# EasyEDA Pro project 电池盒升压.eprj

# Schematic Schematic1
Board Name: Board1; Create Date: 2025-10-24; Page Name: P1; Project Name: 电池盒升压; Schematic Name: Schematic1; Update Date: 2025-10-24; Company: 嘉立创EDA; Page Size: A4; Version: V1.0
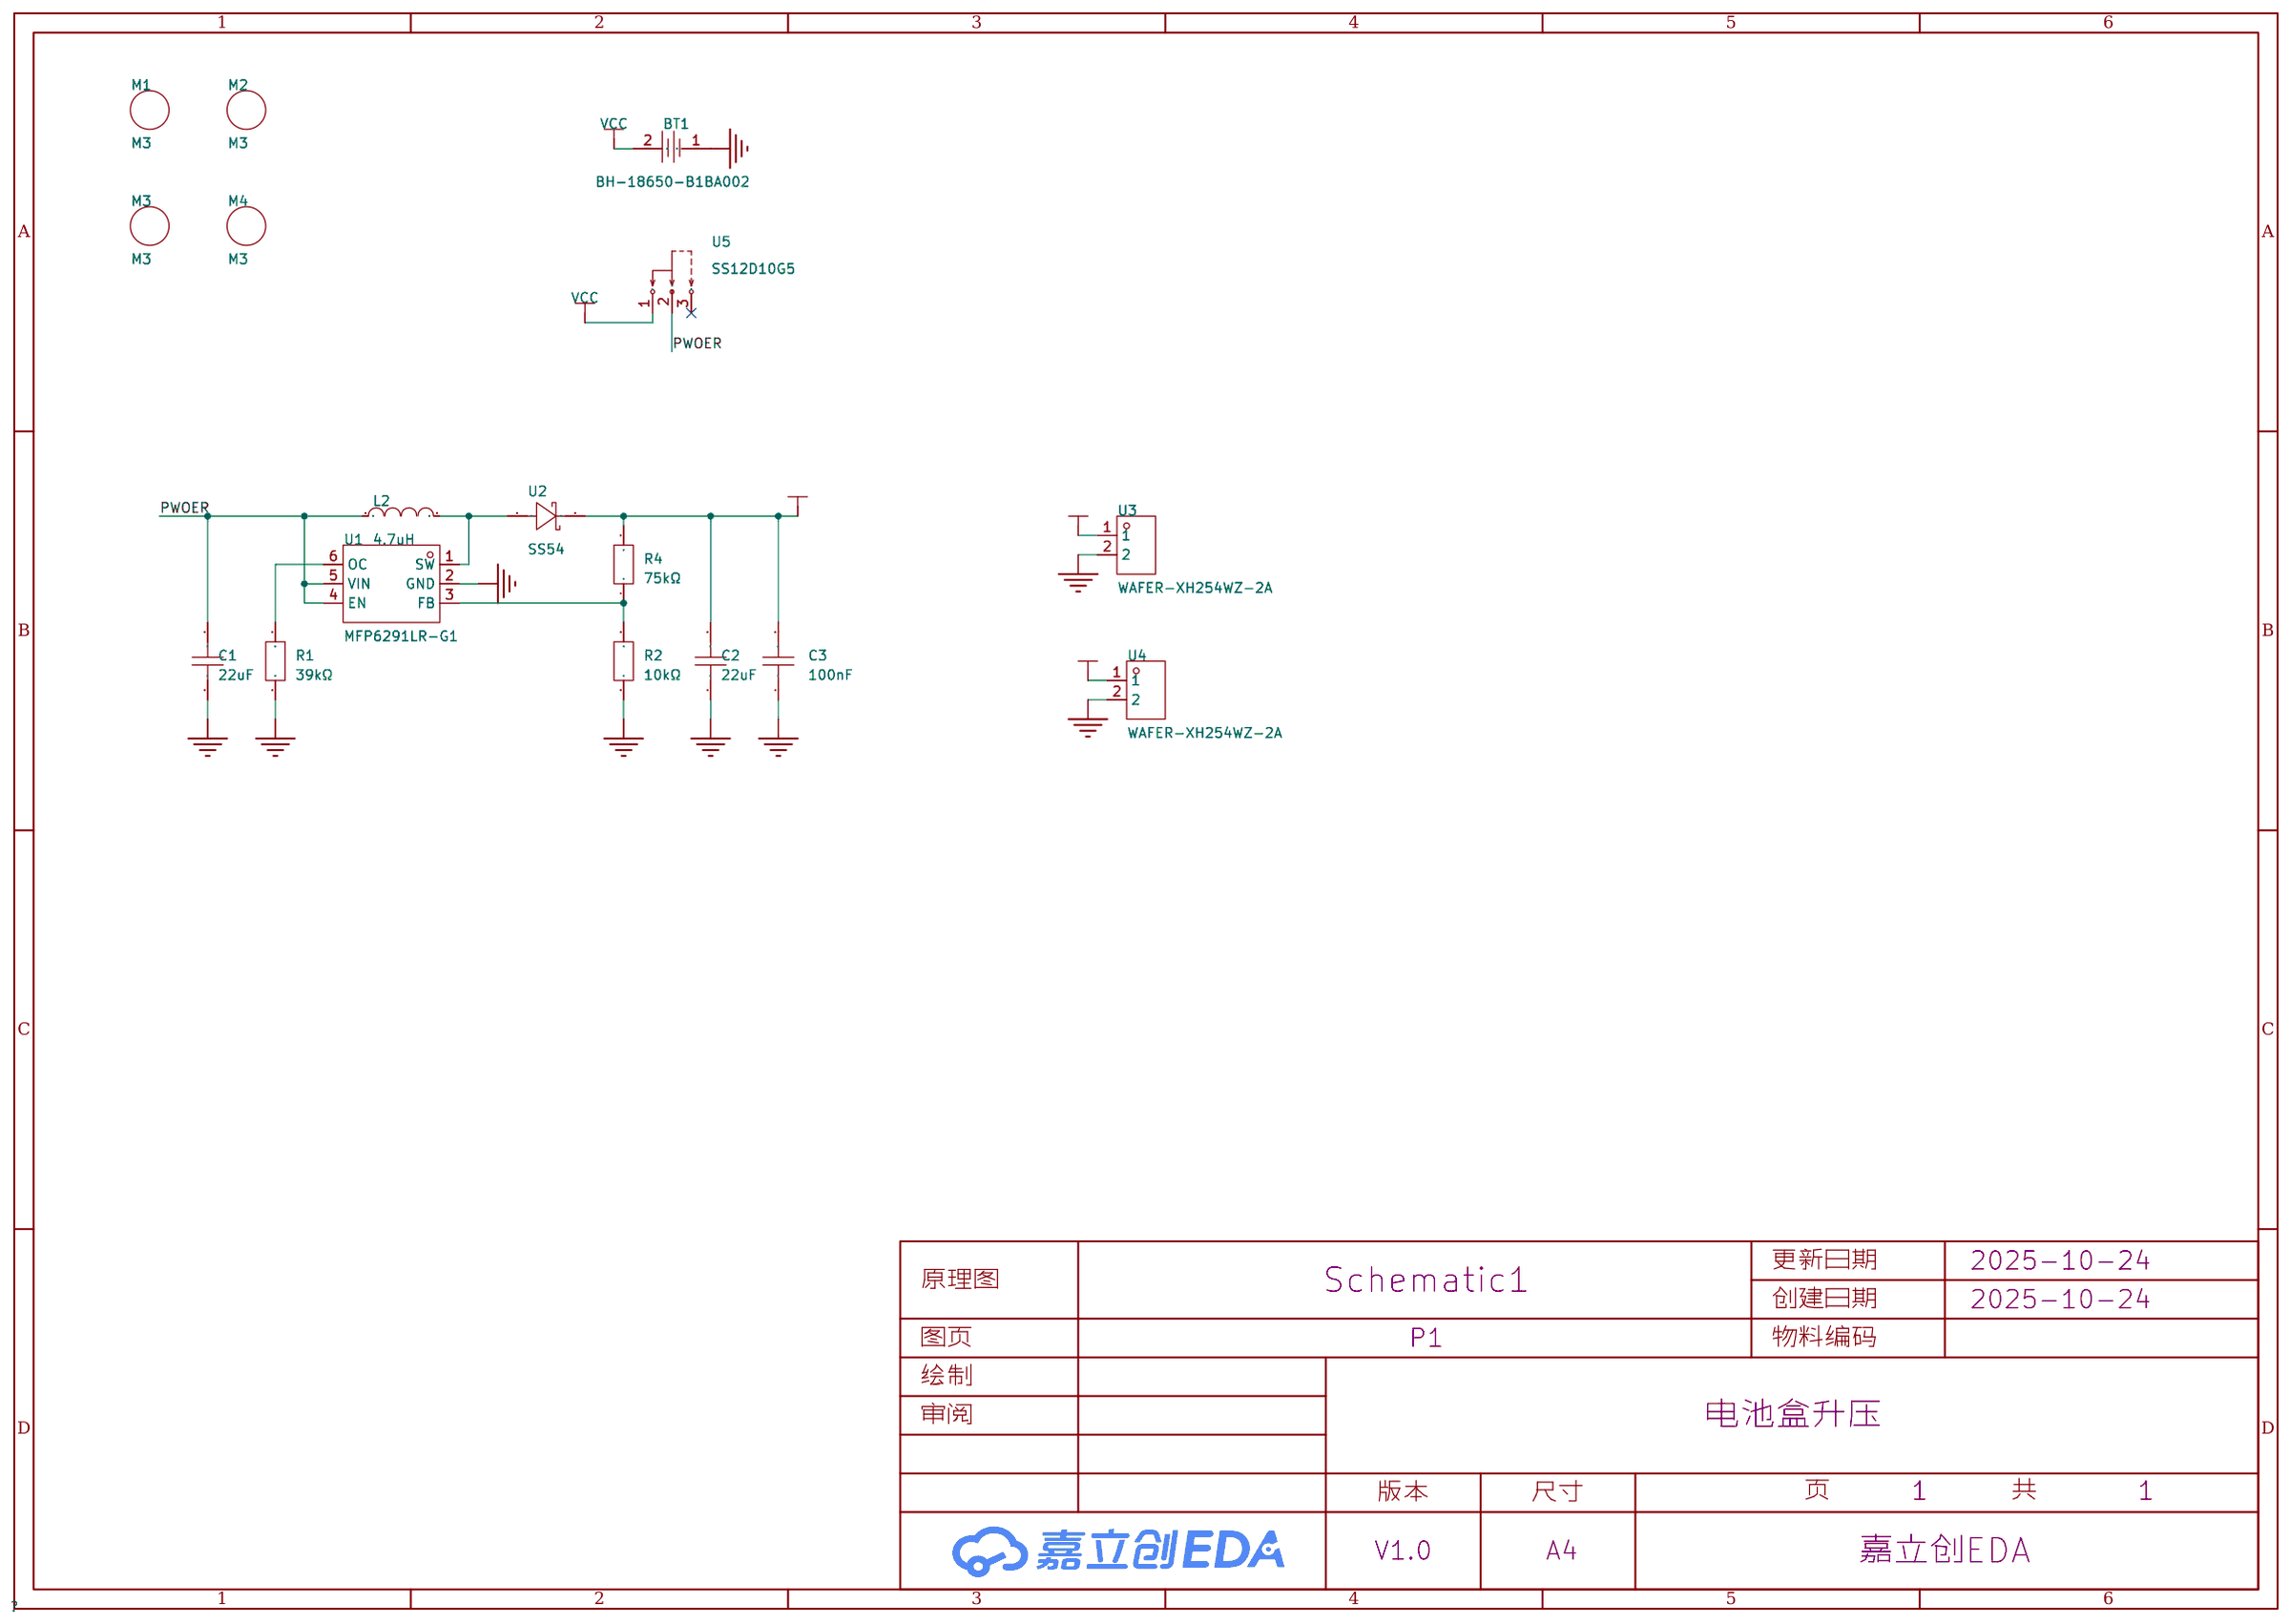
[diagram p0: schematic sheet]

## Parts
BT1  BH-18650-B1BA002  [BATTERY-SMD_18650-1S-L77.1-W20.7-1]
C1  22uF  [C0805]
C2  22uF  [C0805]
C3  100nF  [C0603]
L2  4.7uH  [IND-SMD_L5.4-W5.2_FXL0530]
M1  M3  [m3螺丝孔]
M2  M3  [m3螺丝孔]
M3  M3  [m3螺丝孔]
M4  M3  [m3螺丝孔]
R1  39kΩ  [R0603]
R2  10kΩ  [R0603]
R4  75kΩ  [R0603]
U1  MFP6291LR-G1  [SOT-23-6_L2.9-W1.6-P0.95-LS2.8-BR]
U2  SS54  [SMB_L4.3-W3.6-LS5.4-RD]
U3  WAFER-XH254WZ-2A  [CONN-TH_2P-P2.50_WAFER-XH254WZ-2A]
U4  WAFER-XH254WZ-2A  [CONN-TH_2P-P2.50_WAFER-XH254WZ-2A]
U5  SS12D10G5  [SW-TH_SHOU-HAN_SS12D10G4]

## Library data of the parts
BT1 = BH-18650-B1BA002: LCSC Part Name: 电池盒 适用电池:18650; Supplier Part: C2988620; Manufacturer: MYOUNG(美阳); Supplier Footprint: SMD; JLCPCB Part Class: 扩展库; Datasheet: https://item.szlcsc.com/datasheet/BH-18650-B1BA002/3446919.html; Supplier: LCSC; Connector Type: 电池盒; Battery Type: 18650
C1 C2 = 0805X5R226M160NT: LCSC Part Name: 22uF ±20% 16V; Supplier Part: C49326686; Manufacturer: AIDE(爱迪电容); Supplier Footprint: 0805; JLCPCB Part Class: 扩展库; Datasheet: https://item.szlcsc.com/datasheet/0805X5R226M160NT/51802516.html; Supplier: LCSC; Tolerance: ±20%; Voltage Rating: 16V; Temperature Coefficient: X5R
C3 = NL0603B104M500CPBN: LCSC Part Name: 100nF ±20% 50V; Supplier Part: C45369465; Manufacturer: HUI JU(汇聚); Supplier Footprint: 0603; Datasheet: https://item.szlcsc.com/datasheet/NL0603B104M500CPBN/47466580.html; Supplier: LCSC; Tolerance: ±20%; Voltage Rating: 50V
L2 = FXL0530-4R7-M: LCSC Part Name: 4.7uH ±20% 5A; Supplier Part: C177246; Manufacturer: cjiang(长江微电); Supplier Footprint: SMD,5.4x5.2mm; JLCPCB Part Class: 扩展库; Datasheet: https://item.szlcsc.com/datasheet/FXL0530-4R7-M/188638.html; Supplier: LCSC; Tolerance: ±20%; Current Rating: 4.5A; Current - Saturation(Isat): 5A; DC Resistance(DCR): 60mΩ; Type: 一体成型电感
M1-M4 = M3: 铜柱孔; BOM名称: 铜柱孔; 学习资源: www.ooocke.com; 版权归属: 源创客; Origin Footprint 2: M3 140X350; Origin Footprint 3: M3 125X300; Origin Footprint 1: M3 125X200; Library Name: Schlib1
R1 = PTFR0603B39K0N9: LCSC Part Name: 薄膜电阻 39kΩ ±0.1% 100mW; Supplier Part: C5382624; Manufacturer: RESI(开步睿思); Supplier Footprint: 0603; JLCPCB Part Class: 扩展库; Datasheet: https://item.szlcsc.com/datasheet/PTFR0603B39K0N9/6255159.html; Supplier: LCSC; Type: 薄膜电阻; Tolerance: ±0.1%; Power(Watts): 100mW; Voltage-Supply(Max): 100V; Temperature Coefficient: ±10ppm/℃; Operating Temperature: -55℃~+155℃
R2 = TC0350B1002T5F: LCSC Part Name: 10kΩ ±0.1% 100mW 薄膜电阻; Supplier Part: C2989264; Manufacturer: UNI-ROYAL(厚声); Supplier Footprint: 0603; JLCPCB Part Class: 扩展库; Datasheet: https://item.szlcsc.com/datasheet/TC0350B1002T5F/3448687.html; Supplier: LCSC; Type: 薄膜电阻; Tolerance: ±0.1%; Power(Watts): 100mW; Voltage-Supply(Max): 75V; Temperature Coefficient: ±50ppm/℃; Operating Temperature: -55℃~+155℃
R4 = PTFR0603B75K0N9: LCSC Part Name: 薄膜电阻 75kΩ ±0.1% 100mW; Supplier Part: C2692749; Manufacturer: RESI(开步睿思); Supplier Footprint: 0603; JLCPCB Part Class: 扩展库; Datasheet: https://atta.szlcsc.com/upload/public/pdf/source/20240506/11BDC7478D84177AC2A5326A65B6EB29.pdf; Supplier: LCSC; Type: 薄膜电阻; Tolerance: ±0.1%; Power(Watts): 100mW; Voltage-Supply(Max): 100V; Temperature Coefficient: ±10ppm/℃; Operating Temperature: -55℃~+125℃
U1 = MFP6291LR-G1: LCSC Part Name: 高效能DC-DC转换器; Supplier Part: C30197559; Manufacturer: MSKSEMI(美森科); Supplier Footprint: SOT-23-6; JLCPCB Part Class: 扩展库; Datasheet: https://atta.szlcsc.com/upload/public/pdf/source/20240802/EF2DD005FADFCD3BE676F2A110248FCE.pdf; Supplier: LCSC; Function: 升压型; Output Type: 可调; Input Voltage: 2.2V~16V; Output Voltage: 5V~20V; Output Current: 2.5A; Switching Frequency: 1.2MHz; Operating Temperature: -40℃~+85℃; Synchronous Rectification: 否; Number of Outputs: 1; Topology: 升压式; Quiescent Current (Iq): 2.2mA; Switch tube (built-in/external): 内置
U2 = SS54_C5200096: LCSC Part Name: IF:5A VR:40V VF:0.55V IFSM:150A; Supplier Part: C5200096; Manufacturer: HXY MOSFET(华轩阳电子); Supplier Footprint: SMB; JLCPCB Part Class: 扩展库; Datasheet: https://item.szlcsc.com/datasheet/SS54/5888311.html; Supplier: LCSC; Diode Configuration: 独立式; Voltage - Forward(Vf@If): 550mV@5A; Voltage - DC Reverse(Vr): 40V; Current - Rectified: 5A; Reverse Leakage Current (Ir): 500uA; Operating Junction Temperature Range: -55℃~+125℃; Non-Repetitive Peak Forward Surge Current: 150A
U3 U4 = WAFER-XH254WZ-2A: LCSC Part Name: 1x2P 间距:2.54mm 弯插 系列:XH; Supplier Part: C7432691; Manufacturer: HANBO(汉博); Supplier Footprint: 插件,P=2.5mm; JLCPCB Part Class: 扩展库; Datasheet: https://item.szlcsc.com/datasheet/WAFER-XH254WZ-2A/8437688.html; Supplier: LCSC; Pins Structure: 1x2P; Pitch: 2.54mm; Mounting Type: 弯插; Reference Series: XH; Number of Pins: 2P; Number of Rows: 1; Number of PINs Per Row: 2; Current Rating: 3A; Contact Material: 黄铜; Operating Temperature: -25℃~+85℃; Voltage Rating: 250V; Plastic Material: PA66; Flame Retardant Rating: UL94V-0
U5 = SS12D10G5: LCSC Part Name: 两档立式插件 3脚拨动开关 柄长5.0mm; Supplier Part: C7431054; Manufacturer: SHOU HAN(首韩); Supplier Footprint: 插件,12.7x6.7mm; JLCPCB Part Class: 扩展库; Datasheet: https://item.szlcsc.com/datasheet/SS12D10G5/8431406.html; Supplier: LCSC; Circuit: 单刀双掷; Length: 12.7mm; Width: 6.7mm; Mounting Type: 直插; Current Rating: 2A; Voltage Rating: 125V; Life: 3千次; Operating Temperature: -25℃~+70℃

## Nets
GND: BT1.1 C1.1 C2.1 C3.1 R1.1 R2.1 U1.2(GND) U3.2 U4.2
VCC: BT1.2 U5.1
PWOER: C1.2 L2.1 U1.4(EN) U1.5(VIN) U5.2
VOUT: C2.2 C3.2 R4.2 U2.1 U3.1 U4.1
$1N557: R1.2 U1.6(OC)
$1N720: L2.2 U1.1(SW) U2.2
$1N1074: R2.2 R4.1 U1.3(FB)

Not connected (* = marked no-connect by the designer): U5 3*

# Board PCB1
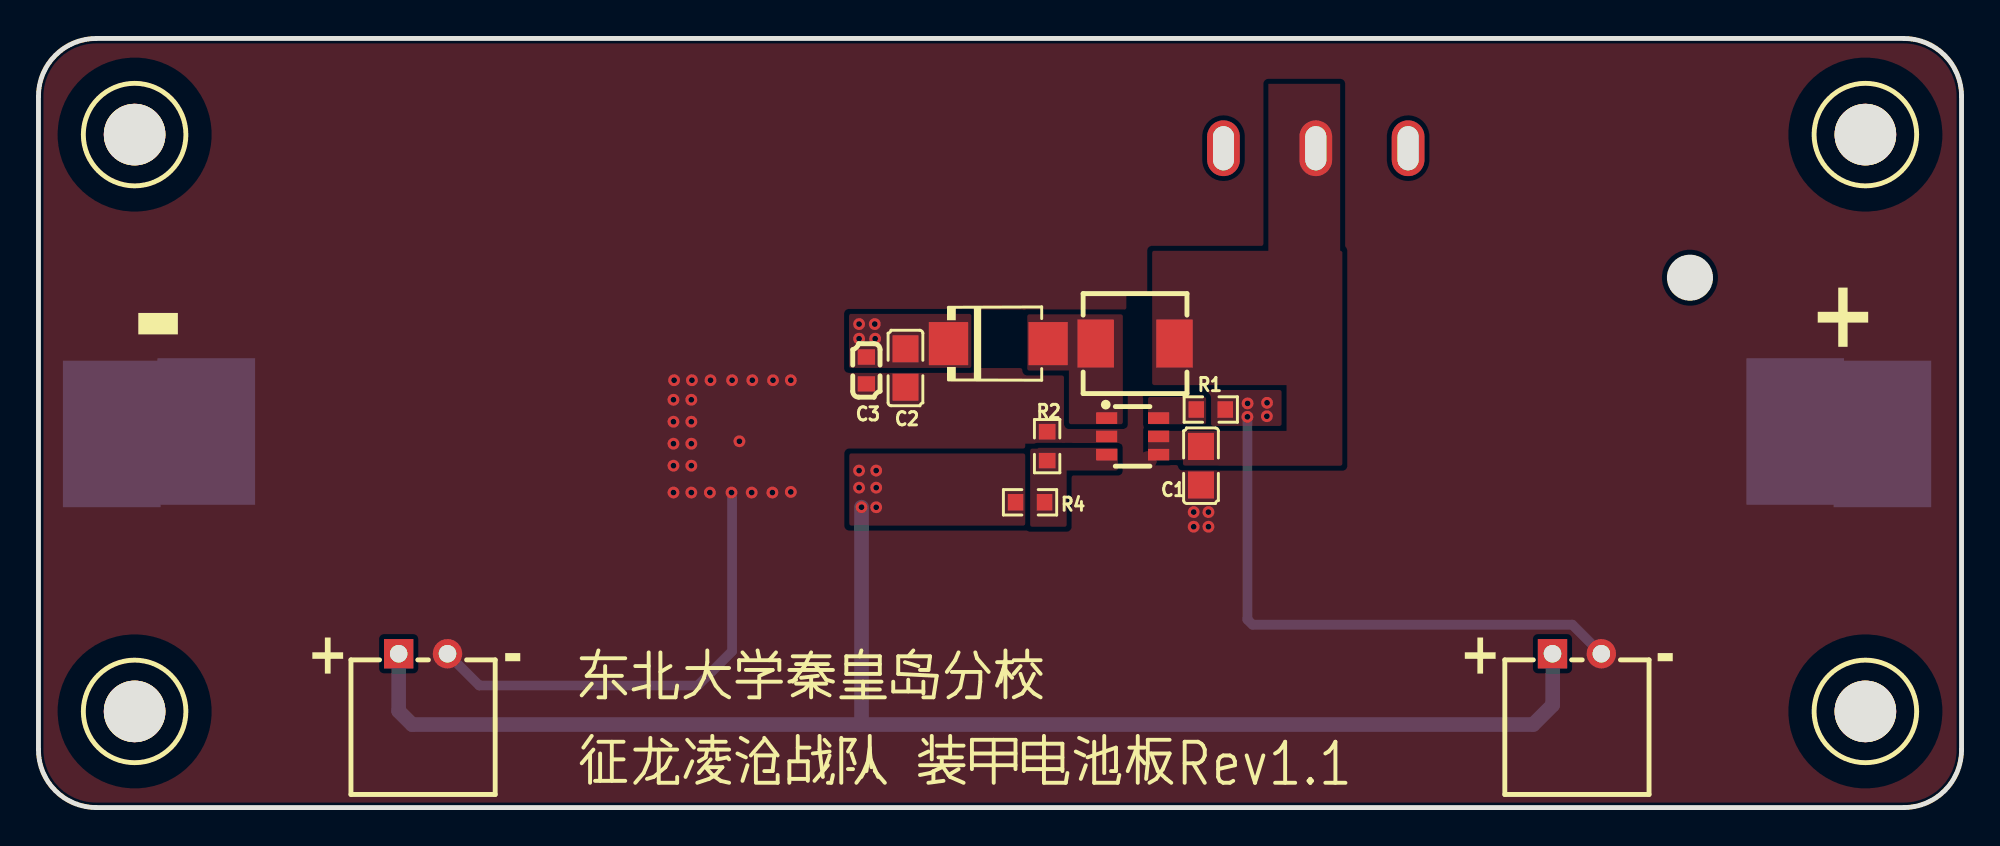
[diagram p1: board, top side]
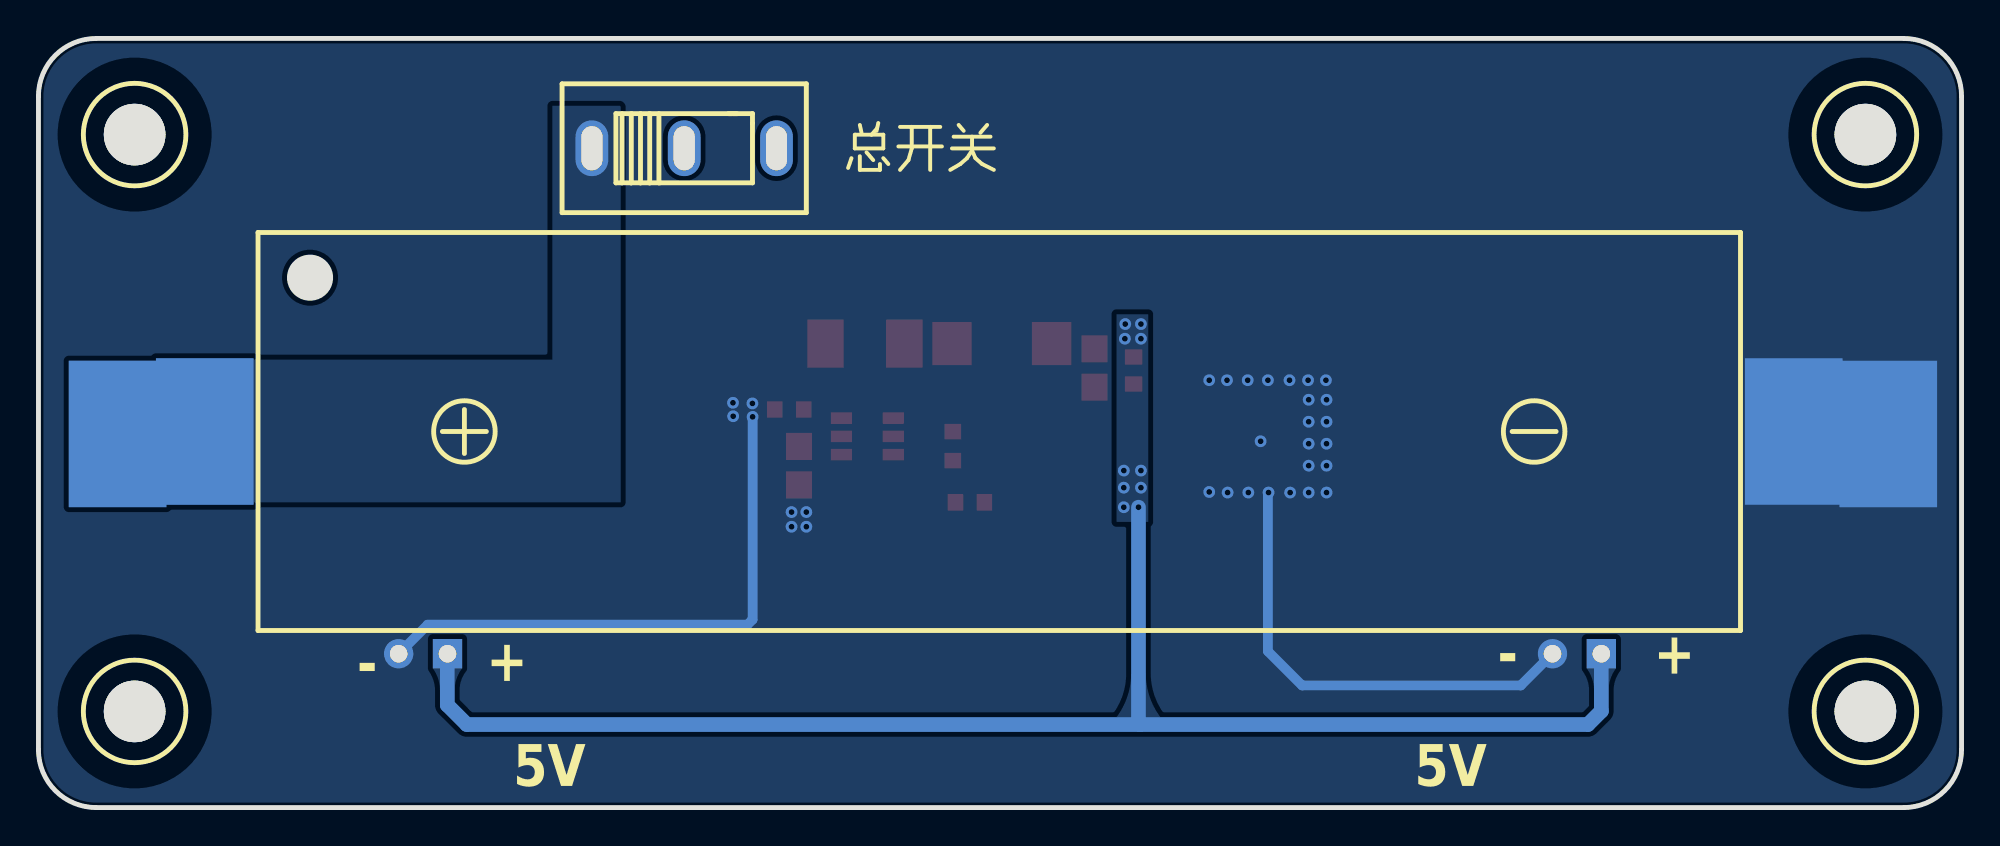
[diagram p2: board, bottom side, seen from below]

Outline 100 x 40 mm; copper layers: Top Layer, Bottom Layer. Coordinates in mm from the lower left corner of the outline.
Outline path: 0,37 0,3 arc(0.88,0.88) 3,0 97,0 arc(99.12,0.88) 100,3 100,37 arc(99.12,39.12) 97,40 3,40 arc(0.88,39.12) 0,37
Stack: Top Layer 0.035mm / Dielectric1 1.51mm FR4 er 4.5 / Bottom Layer 0.035mm

## Design rules (mm)
template: 自定义配置
spacing copperThickness1oz (default): track to track 0.102, other pairs 0.152 to 0.3
spacing copperThickness2oz: track to track 0.203, other pairs 0.152 to 0.3
track width copperThickness1oz (default): min 0.127, default 0.254, max 2.54
track width copperThickness2oz: min 0.203, default 0.254, max 2.54
differential pair differentialPair (default): width min 0.127, default 0.254, max 2.54; gap min 0.152, default 0.152
via viaSize (default): diameter min 0.5, default 0.61, max 10; hole min 0.3, default 0.305, max 6.3

## Placement (name value [footprint] x y rotation side)
BT1  BH-18650-B1BA002  [BATTERY-SMD_18650-1S-L77.1-W20.7-1]  50.04 19.56 90 bottom
C1  22uF  [C0805]  60.45 17.78 90 top
C2  22uF  [C0805]  45.09 22.86 90 top
C3  100nF  [C0603]  43.05 22.73 90 top
L2  4.7uH  [IND-SMD_L5.4-W5.2_FXL0530]  57.02 24.13 180 top
M1  M3  [m3螺丝孔]  5 5 0 top
M2  M3  [m3螺丝孔]  95 5 0 top
M3  M3  [m3螺丝孔]  5 35 0 top
M4  M3  [m3螺丝孔]  95 35 0 top
NOREF  -  [Pad_e20]  3.81 19.43 90 top
NOREF#2  -  [Pad_e22]  95.88 19.43 90 top
R1  39kΩ  [R0603]  60.96 20.7 180 top
R2  10kΩ  [R0603]  52.45 18.8 270 top
R4  75kΩ  [R0603]  51.56 15.88 180 top
U1  MFP6291LR-G1  [SOT-23-6_L2.9-W1.6-P0.95-LS2.8-BR]  56.9 19.3 180 top
U2  SS54  [SMB_L4.3-W3.6-LS5.4-RD]  49.91 24.13 0 top
U3  WAFER-XH254WZ-2A  [CONN-TH_2P-P2.50_WAFER-XH254WZ-2A]  20 8 0 top
U4  WAFER-XH254WZ-2A  [CONN-TH_2P-P2.50_WAFER-XH254WZ-2A]  80 8 0 top
U5  SS12D10G5  [SW-TH_SHOU-HAN_SS12D10G4]  66.42 34.29 180 bottom

## Footprints (pads in the part's own frame, mm; a bottom-side part is the same pattern mirrored in y, then rotated)
BATTERY-SMD_18650-1S-L77.1-W20.7-1
  rect 7.62x5.08 smd: 1(0,-41.313) 2(0,41.313)
C0603
  rect 0.8x0.9 smd: 1(-0.7,0) 2(0.7,0)
C0805
  rect 1.41x1.35 smd: 1(-1,0) 2(1,0)
CONN-TH_2P-P2.50_WAFER-XH254WZ-2A
  rect 1.524x1.524 hole 0.914: 1(-1.27,0)
  round 1.524 hole 0.914: 2(1.27,0)
IND-SMD_L5.4-W5.2_FXL0530
  rect 1.9x2.5 smd: 1(-2.05,0) 2(2.05,0)
m3螺丝孔
  round 3.2 hole 3.2: 1(0,0)
Pad_e20
  rect 7.62x5.08 smd far side: 1(0,0)
Pad_e22
  rect 7.62x5.08 smd far side: 1(0,0)
R0603
  rect 0.806x0.864 smd: 1(-0.753,0) 2(0.753,0)
SMB_L4.3-W3.6-LS5.4-RD
  rect 2.047x2.241 smd: 1(-2.591,0) 2(2.591,0)
SOT-23-6_L2.9-W1.6-P0.95-LS2.8-BR
  rect 1.1x0.6 smd: 1(1.35,-0.95) 2(1.35,0) 3(1.35,0.95) 4(-1.35,0.95) 5(-1.35,0) 6(-1.35,-0.95)
SW-TH_SHOU-HAN_SS12D10G4
  oval 1.7x2.9 hole 1.1x2.3: 1(-4.8,0) 2(0,0) 3(4.8,0)

## Nets
GND: BT1.1 C1.1 C2.1 C3.1 NOREF.1 R1.1 R2.1 U1.2 U3.2 U4.2
VCC: BT1.2 NOREF#2.1 U5.1
PWOER: C1.2 L2.1 U1.4 U1.5 U5.2
VOUT: C2.2 C3.2 R4.2 U2.1 U3.1 U4.1
$1N557: R1.2 U1.6
$1N720: L2.2 U1.1 U2.2
$1N1074: R2.2 R4.1 U1.3

Pads without a net: M1 1; M2 1; M3 1; M4 1; U5 3

## Via types
v1: diameter 0.61, hole 0.305, Top Layer to Bottom Layer, 41 vias

## Routing (per net, layer and track width the routed paths; a pad name or vN(x,y) marks a point on that pad's centre or on a via; arc(x,y) is an arc through that point)
GND: length 54.2
  Bottom Layer w0.508: v1(36.04,16.38) 36.07,16.35 36.07,8.13 34.29,6.35 22.92,6.35 U3.2 ; v1(62.87,20.32) 62.87,9.78 63.13,9.51 79.76,9.51 U4.2
  vias: v1(33.02,21.21) v1(33.02,20.07) v1(33.02,18.92) v1(33.02,17.78) v1(33.02,16.38) v1(33.05,22.22) v1(33.95,21.21) v1(33.95,20.07) v1(33.95,18.92) v1(33.95,17.78) v1(33.95,16.38) v1(33.98,22.22) v1(34.95,22.22) v1(34.91,16.38) v1(36.07,22.22) v1(36.45,19.05) v1(37.12,22.22) v1(37.09,16.38) v1(38.2,22.22) v1(38.16,16.38) v1(39.12,22.22) v1(39.12,16.41) v1(60.07,15.37) v1(60.07,14.61) v1(60.84,15.37) v1(60.84,14.61) v1(62.88,21.02) v1(63.89,21.05) v1(63.88,20.35)
VOUT: length 77.7
  Bottom Layer w0.762: 42.72,4.32 77.72,4.32 78.74,5.33 78.74,7.99 U4.1 ; 42.72,4.32 42.8,4.4 v1(42.8,15.62) ; 42.72,4.32 19.43,4.32 18.73,5.02 U3.1
  vias: v1(42.67,25.15) v1(42.67,24.38) v1(42.67,17.53) v1(42.67,16.64) v1(43.49,25.15) v1(43.51,24.38) v1(43.56,17.53) v1(43.56,16.64) v1(43.56,15.62)

## Copper pours and planes (outline as drawn; the poured copper is in the pictures)
GND on Top Layer: -4.57,42.16 102.74,42.16 102.74,-4.83 -4.57,-4.83
GND on Top Layer: 53.42,18.92 33.66,18.92 33.66,22.61 49.94,22.61 49.94,20.07 53.42,20.07
GND on Top Layer: 59.69,17.53 61.34,17.53 61.34,13.72 59.69,13.72
GND on Top Layer: 59.56,17.53 61.34,17.53 61.34,15.86 56.38,15.86 56.38,18.88 56.33,18.92 53.21,18.92 53.21,19.73 57.45,19.73 57.45,17.52 59.56,17.52
GND on Top Layer: 61.34,21.34 64.39,21.34 64.39,19.94 61.34,19.94
GND on Bottom Layer: 1.27,23.11 39.75,23.11 39.75,15.62 1.27,15.62
GND on Bottom Layer: -4.06,44.2 105.03,44.2 105.03,-4.83 -4.06,-4.83
VCC on Bottom Layer: 69.72,36.5 93.6,36.5 93.6,15.88 69.72,15.88
PWOER on Top Layer: 57.7,19.59 61.36,19.59 61.36,18.07 57.7,18.07
PWOER on Top Layer: 63.95,37.64 67.69,37.64 67.69,26.8 63.95,26.8
PWOER on Top Layer: 57.91,21.97 57.91,28.96 67.8,28.96 67.8,17.78 59.51,17.78 59.51,19.59 64.9,19.59 64.9,21.97
VOUT on Top Layer: 42.15,25.68 48.51,25.68 48.51,22.86 42.15,22.86
VOUT on Top Layer: 42.16,18.42 51.56,18.42 51.56,14.66 42.16,14.66
VOUT on Bottom Layer: 42.29,25.65 43.94,25.65 43.94,14.86 42.29,14.86
$1N557 on Top Layer: 57.7,19.93 60.72,19.93 60.72,21.31 60.67,21.36 57.68,21.36 57.7,21.35
$1N720 on Top Layer: 56.39,19.94 56.39,25.65 51.42,25.65 51.42,22.73 53.59,22.73 53.59,19.94
$1N1074 on Top Layer: 51.57,18.92 53.47,18.92 53.47,14.61 51.57,14.61
$1N1074 on Top Layer: 56.13,18.71 51.94,18.71 51.94,17.53 51.94,17.53 56.13,17.53

Small or netless copper shapes (teardrops, artwork), in the pictures only: 7 on Bottom Layer

## Text on the board
Bottom Silkscreen Layer: + | - | 5V | 总开关
Top Silkscreen Layer: + | - | 东北大学秦皇岛分校 | 征龙凌沧战队 装甲电池板Rev1.1
